# Altium schematic sheet FPGA_Ports.SchDoc
size 558 x 431 mm; SheetNumber: 7; SheetTotal: 13
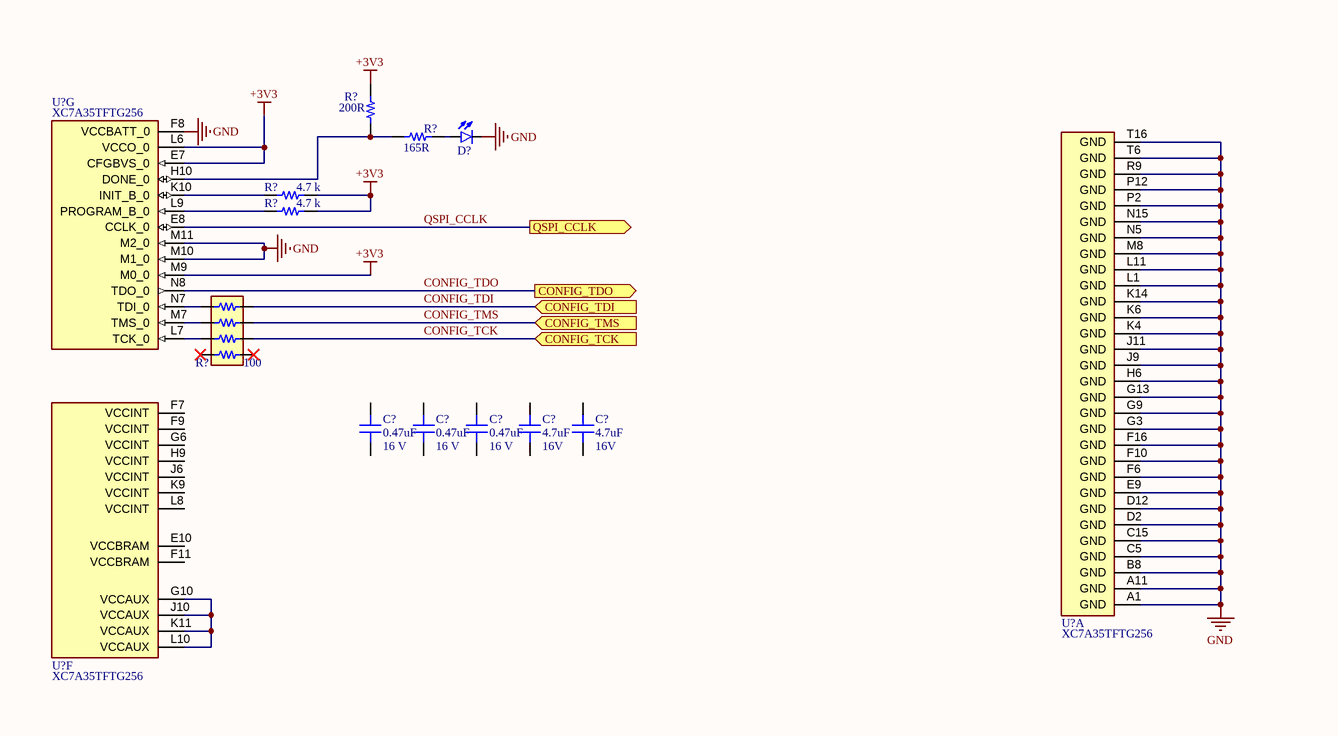
[diagram p0: FPGA_Ports.SchDoc, top right]
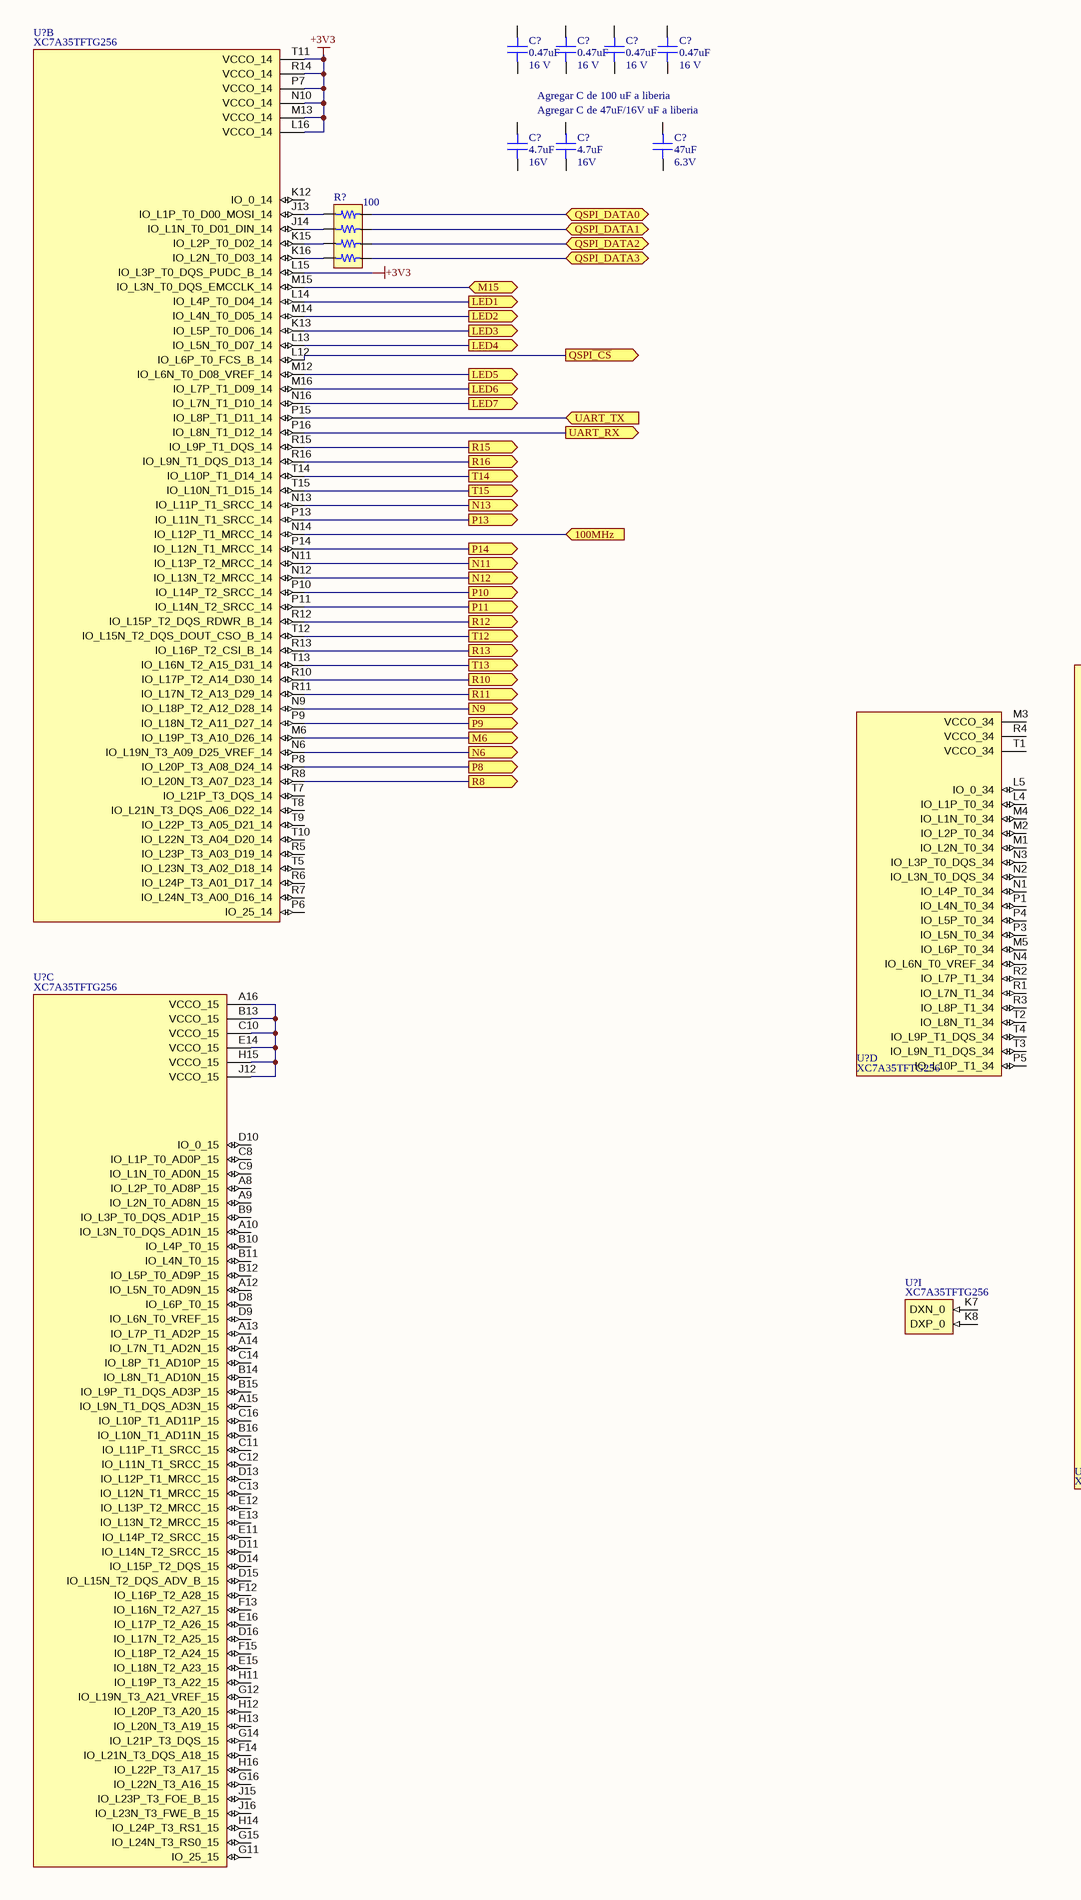
[diagram p1: FPGA_Ports.SchDoc, bottom left]
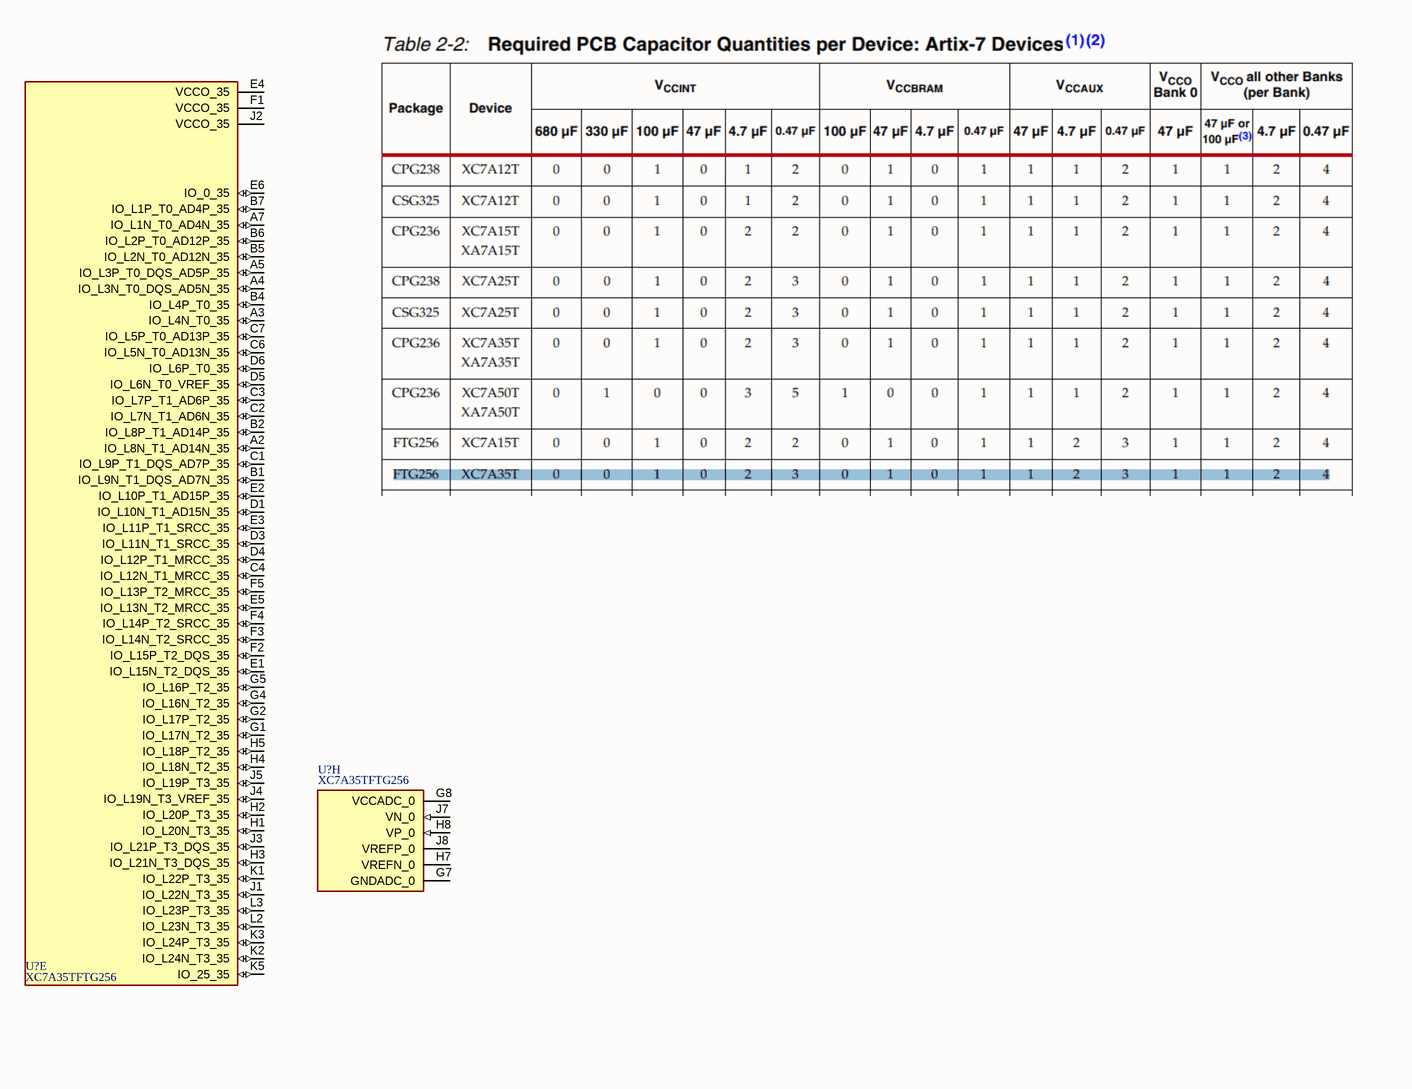
[diagram p2: FPGA_Ports.SchDoc, bottom right]

## Parts
(Parts that share a designator on the sheet are numbered #1, #2 ... from top to bottom, then left to right.)
C?#1  0.47uF  Voltage: 16 V  [CAP0805]
C?#2  0.47uF  Voltage: 16 V  [CAP0805]
C?#3  0.47uF  Voltage: 16 V  [CAP0805]
C?#4  0.47uF  Voltage: 16 V  [CAP0805]
C?#5  4.7uF  Voltage: 16V  [CAP0805]
C?#6  4.7uF  Voltage: 16V  [CAP0805]
C?#7  47uF  Voltage: 6.3V  [CAP0805]
C?#8  0.47uF  Voltage: 16 V  [CAP0805]
C?#9  0.47uF  Voltage: 16 V  [CAP0805]
C?#10  0.47uF  Voltage: 16 V  [CAP0805]
C?#11  4.7uF  Voltage: 16V  [CAP0805]
C?#12  4.7uF  Voltage: 16V  [CAP0805]
D?  597-3305-607F  [0603_LED]  (value not drawn)
R?#1  200R  [RES0603]
R?#2  165R  [RES0603]
R?#3  4.7 k  [RES0603]
R?#4  4.7 k  [RES0603]
R?#5  100  [ArrayResistor-1206]
R?#6  100  [ArrayResistor-1206]
U?#1  XC7A35TFTG256  [BGA-256]  (part G of 9)
U?#2  XC7A35TFTG256  [BGA-256]  (part A of 9)
U?#3  XC7A35TFTG256  [BGA-256]  (part F of 9)
U?#4  XC7A35TFTG256  [BGA-256]  (part B of 9)
U?#5  XC7A35TFTG256  [BGA-256]  (part D of 9)
U?#6  XC7A35TFTG256  [BGA-256]  (part I of 9)
U?#7  XC7A35TFTG256  [BGA-256]  (part H of 9)
U?#8  XC7A35TFTG256  [BGA-256]  (part E of 9)
U?#9  XC7A35TFTG256  [BGA-256]  (part C of 9)

## Ports
100MHz (in), CONFIG_TCK (in), CONFIG_TDI (in), CONFIG_TDO (out), CONFIG_TMS (in), LED1 (out), LED2 (out), LED3 (out), LED4 (out), LED5 (out), LED6 (out), LED7 (out), M6 (out), M15 (bidir), N6 (out), N9 (out), N11 (out), N12 (out), N13 (out), P8 (out), P9 (out), P10 (out), P11 (out), P13 (out), P14 (out), QSPI_CCLK (out), QSPI_DATA0 (bidir), QSPI_DATA1 (bidir), QSPI_DATA2 (bidir), QSPI_DATA3 (bidir), QSPI~{_CS} (out), R8 (out), R10 (out), R11 (out), R12 (out), R13 (out), R15 (out), R16 (out), T12 (out), T13 (out), T14 (out), T15 (out), UART_RX (out), UART_TX (in)

## Nets
+3V3: R?#1.2 R?#3.1 R?#4.1 U?#1.E7(CFGBVS_0) U?#1.L6(VCCO_0) U?#1.M9(M0_0) U?#4.L15(IO_L3P_T0_DQS_PUDC_B_14) U?#4.L16(VCCO_14) U?#4.M13(VCCO_14) U?#4.N10(VCCO_14) U?#4.P7(VCCO_14) U?#4.R14(VCCO_14) U?#4.T11(VCCO_14)
GND: D?.C U?#1.F8(VCCBATT_0) U?#1.M10(M1_0) U?#1.M11(M2_0) U?#2.A1(GND) U?#2.A11(GND) U?#2.B8(GND) U?#2.C5(GND) U?#2.C15(GND) U?#2.D2(GND) U?#2.D12(GND) U?#2.E9(GND) U?#2.F6(GND) U?#2.F10(GND) U?#2.F16(GND) U?#2.G3(GND) U?#2.G9(GND) U?#2.G13(GND) U?#2.H6(GND) U?#2.J9(GND) U?#2.J11(GND) U?#2.K4(GND) U?#2.K6(GND) U?#2.K14(GND) U?#2.L1(GND) U?#2.L11(GND) U?#2.M8(GND) U?#2.N5(GND) U?#2.N15(GND) U?#2.P2(GND) U?#2.P12(GND) U?#2.R9(GND) U?#2.T6(GND) U?#2.T16(GND)
100MHz: U?#4.N14(IO_L12P_T1_MRCC_14) ; port 100MHz
CONFIG_TCK: R?#6.6 ; port CONFIG_TCK
CONFIG_TDI: R?#6.8 ; port CONFIG_TDI
CONFIG_TDO: U?#1.N8(TDO_0) ; port CONFIG_TDO
CONFIG_TMS: R?#6.7 ; port CONFIG_TMS
LED1: U?#4.L14(IO_L4P_T0_D04_14) ; port LED1
LED2: U?#4.M14(IO_L4N_T0_D05_14) ; port LED2
LED3: U?#4.K13(IO_L5P_T0_D06_14) ; port LED3
LED4: U?#4.L13(IO_L5N_T0_D07_14) ; port LED4
LED5: U?#4.M12(IO_L6N_T0_D08_VREF_14) ; port LED5
LED6: U?#4.M16(IO_L7P_T1_D09_14) ; port LED6
LED7: U?#4.N16(IO_L7N_T1_D10_14) ; port LED7
M6: U?#4.M6(IO_L19P_T3_A10_D26_14) ; port M6
M15: U?#4.M15(IO_L3N_T0_DQS_EMCCLK_14) ; port M15
N6: U?#4.N6(IO_L19N_T3_A09_D25_VREF_14) ; port N6
N9: U?#4.N9(IO_L18P_T2_A12_D28_14) ; port N9
N11: U?#4.N11(IO_L13P_T2_MRCC_14) ; port N11
N12: U?#4.N12(IO_L13N_T2_MRCC_14) ; port N12
N13: U?#4.N13(IO_L11P_T1_SRCC_14) ; port N13
P8: U?#4.P8(IO_L20P_T3_A08_D24_14) ; port P8
P9: U?#4.P9(IO_L18N_T2_A11_D27_14) ; port P9
P10: U?#4.P10(IO_L14P_T2_SRCC_14) ; port P10
P11: U?#4.P11(IO_L14N_T2_SRCC_14) ; port P11
P13: U?#4.P13(IO_L11N_T1_SRCC_14) ; port P13
P14: U?#4.P14(IO_L12N_T1_MRCC_14) ; port P14
QSPI~{_CS}: U?#4.L12(IO_L6P_T0_FCS_B_14) ; port QSPI~{_CS}
QSPI_CCLK: U?#1.E8(CCLK_0) ; port QSPI_CCLK
QSPI_DATA0: R?#5.8 ; port QSPI_DATA0
QSPI_DATA1: R?#5.7 ; port QSPI_DATA1
QSPI_DATA2: R?#5.6 ; port QSPI_DATA2
QSPI_DATA3: R?#5.5 ; port QSPI_DATA3
R8: U?#4.R8(IO_L20N_T3_A07_D23_14) ; port R8
R10: U?#4.R10(IO_L17P_T2_A14_D30_14) ; port R10
R11: U?#4.R11(IO_L17N_T2_A13_D29_14) ; port R11
R12: U?#4.R12(IO_L15P_T2_DQS_RDWR_B_14) ; port R12
R13: U?#4.R13(IO_L16P_T2_CSI_B_14) ; port R13
R15: U?#4.R15(IO_L9P_T1_DQS_14) ; port R15
R16: U?#4.R16(IO_L9N_T1_DQS_D13_14) ; port R16
T12: U?#4.T12(IO_L15N_T2_DQS_DOUT_CSO_B_14) ; port T12
T13: U?#4.T13(IO_L16N_T2_A15_D31_14) ; port T13
T14: U?#4.T14(IO_L10P_T1_D14_14) ; port T14
T15: U?#4.T15(IO_L10N_T1_D15_14) ; port T15
UART_RX: U?#4.P16(IO_L8N_T1_D12_14) ; port UART_RX
UART_TX: U?#4.P15(IO_L8P_T1_D11_14) ; port UART_TX
NetD?_A: D?.A R?#2.1
NetR?#1_1: R?#1.1 R?#2.2 U?#1.H10(DONE_0)
NetR?#3_2: R?#3.2 U?#1.K10(INIT_B_0)
NetR?#4_2: R?#4.2 U?#1.L9(PROGRAM_B_0)
NetR?#5_1: R?#5.1 U?#4.J13(IO_L1P_T0_D00_MOSI_14)
NetR?#5_2: R?#5.2 U?#4.J14(IO_L1N_T0_D01_DIN_14)
NetR?#5_3: R?#5.3 U?#4.K15(IO_L2P_T0_D02_14)
NetR?#5_4: R?#5.4 U?#4.K16(IO_L2N_T0_D03_14)
NetR?#6_1: R?#6.1 U?#1.N7(TDI_0)
NetR?#6_2: R?#6.2 U?#1.M7(TMS_0)
NetR?#6_3: R?#6.3 U?#1.L7(TCK_0)
NetU?#3_G10: U?#3.G10(VCCAUX) U?#3.J10(VCCAUX) U?#3.K11(VCCAUX) U?#3.L10(VCCAUX)
NetU?#9_A16: U?#9.A16(VCCO_15) U?#9.B13(VCCO_15) U?#9.C10(VCCO_15) U?#9.E14(VCCO_15) U?#9.H15(VCCO_15) U?#9.J12(VCCO_15)

Not connected (* = marked no-connect by the designer): C?#1 1 2; C?#2 1 2; C?#3 1 2; C?#4 1 2; C?#5 1 2; C?#6 1 2; C?#7 1 2; C?#8 1 2; C?#9 1 2; C?#10 1 2; C?#11 1 2; C?#12 1 2; R?#6 4* 5*; U?#3 E10(VCCBRAM) F7(VCCINT) F9(VCCINT) F11(VCCBRAM) G6(VCCINT) H9(VCCINT) J6(VCCINT) K9(VCCINT) L8(VCCINT); U?#4 K12(IO_0_14) P6(IO_25_14) R5(IO_L23P_T3_A03_D19_14) R6(IO_L24P_T3_A01_D17_14) R7(IO_L24N_T3_A00_D16_14) T5(IO_L23N_T3_A02_D18_14) T7(IO_L21P_T3_DQS_14) T8(IO_L21N_T3_DQS_A06_D22_14) T9(IO_L22P_T3_A05_D21_14) T10(IO_L22N_T3_A04_D20_14); U?#5 L4(IO_L1P_T0_34) L5(IO_0_34) M1(IO_L2N_T0_34) M2(IO_L2P_T0_34) M3(VCCO_34) M4(IO_L1N_T0_34) M5(IO_L6P_T0_34) N1(IO_L4P_T0_34) N2(IO_L3N_T0_DQS_34) N3(IO_L3P_T0_DQS_34) N4(IO_L6N_T0_VREF_34) P1(IO_L4N_T0_34) P3(IO_L5N_T0_34) P4(IO_L5P_T0_34) P5(IO_L10P_T1_34) R1(IO_L7N_T1_34) R2(IO_L7P_T1_34) R3(IO_L8P_T1_34) R4(VCCO_34) T1(VCCO_34) T2(IO_L8N_T1_34) T3(IO_L9N_T1_DQS_34) T4(IO_L9P_T1_DQS_34); U?#6 K7(DXN_0) K8(DXP_0); U?#7 G7(GNDADC_0) G8(VCCADC_0) H7(VREFN_0) H8(VP_0) J7(VN_0) J8(VREFP_0); U?#8 A2(IO_L8N_T1_AD14N_35) A3(IO_L4N_T0_35) A4(IO_L3N_T0_DQS_AD5N_35) A5(IO_L3P_T0_DQS_AD5P_35) A7(IO_L1N_T0_AD4N_35) B1(IO_L9N_T1_DQS_AD7N_35) B2(IO_L8P_T1_AD14P_35) B4(IO_L4P_T0_35) B5(IO_L2N_T0_AD12N_35) B6(IO_L2P_T0_AD12P_35) B7(IO_L1P_T0_AD4P_35) C1(IO_L9P_T1_DQS_AD7P_35) C2(IO_L7N_T1_AD6N_35) C3(IO_L7P_T1_AD6P_35) C4(IO_L12N_T1_MRCC_35) C6(IO_L5N_T0_AD13N_35) C7(IO_L5P_T0_AD13P_35) D1(IO_L10N_T1_AD15N_35) D3(IO_L11N_T1_SRCC_35) D4(IO_L12P_T1_MRCC_35) D5(IO_L6N_T0_VREF_35) D6(IO_L6P_T0_35) E1(IO_L15N_T2_DQS_35) E2(IO_L10P_T1_AD15P_35) E3(IO_L11P_T1_SRCC_35) E4(VCCO_35) E5(IO_L13N_T2_MRCC_35) E6(IO_0_35) F1(VCCO_35) F2(IO_L15P_T2_DQS_35) F3(IO_L14N_T2_SRCC_35) F4(IO_L14P_T2_SRCC_35) F5(IO_L13P_T2_MRCC_35) G1(IO_L17N_T2_35) G2(IO_L17P_T2_35) G4(IO_L16N_T2_35) G5(IO_L16P_T2_35) H1(IO_L20N_T3_35) H2(IO_L20P_T3_35) H3(IO_L21N_T3_DQS_35) H4(IO_L18N_T2_35) H5(IO_L18P_T2_35) J1(IO_L22N_T3_35) J2(VCCO_35) J3(IO_L21P_T3_DQS_35) J4(IO_L19N_T3_VREF_35) J5(IO_L19P_T3_35) K1(IO_L22P_T3_35) K2(IO_L24N_T3_35) K3(IO_L24P_T3_35) K5(IO_25_35) L2(IO_L23N_T3_35) L3(IO_L23P_T3_35); U?#9 A8(IO_L2P_T0_AD8P_15) A9(IO_L2N_T0_AD8N_15) A10(IO_L3N_T0_DQS_AD1N_15) A12(IO_L5N_T0_AD9N_15) A13(IO_L7P_T1_AD2P_15) A14(IO_L7N_T1_AD2N_15) A15(IO_L9N_T1_DQS_AD3N_15) B9(IO_L3P_T0_DQS_AD1P_15) B10(IO_L4P_T0_15) B11(IO_L4N_T0_15) B12(IO_L5P_T0_AD9P_15) B14(IO_L8N_T1_AD10N_15) B15(IO_L9P_T1_DQS_AD3P_15) B16(IO_L10N_T1_AD11N_15) C8(IO_L1P_T0_AD0P_15) C9(IO_L1N_T0_AD0N_15) C11(IO_L11P_T1_SRCC_15) C12(IO_L11N_T1_SRCC_15) C13(IO_L12N_T1_MRCC_15) C14(IO_L8P_T1_AD10P_15) C16(IO_L10P_T1_AD11P_15) D8(IO_L6P_T0_15) D9(IO_L6N_T0_VREF_15) D10(IO_0_15) D11(IO_L14N_T2_SRCC_15) D13(IO_L12P_T1_MRCC_15) D14(IO_L15P_T2_DQS_15) D15(IO_L15N_T2_DQS_ADV_B_15) D16(IO_L17N_T2_A25_15) E11(IO_L14P_T2_SRCC_15) E12(IO_L13P_T2_MRCC_15) E13(IO_L13N_T2_MRCC_15) E15(IO_L18N_T2_A23_15) E16(IO_L17P_T2_A26_15) F12(IO_L16P_T2_A28_15) F13(IO_L16N_T2_A27_15) F14(IO_L21N_T3_DQS_A18_15) F15(IO_L18P_T2_A24_15) G11(IO_25_15) G12(IO_L19N_T3_A21_VREF_15) G14(IO_L21P_T3_DQS_15) G15(IO_L24N_T3_RS0_15) G16(IO_L22N_T3_A16_15) H11(IO_L19P_T3_A22_15) H12(IO_L20P_T3_A20_15) H13(IO_L20N_T3_A19_15) H14(IO_L24P_T3_RS1_15) H16(IO_L22P_T3_A17_15) J15(IO_L23P_T3_FOE_B_15) J16(IO_L23N_T3_FWE_B_15)

## Notes on the sheet
- (near C?#2) Agregar C de 100 uF a liberia
- (near C?#6) Agregar C de 47uF/16V uF a liberia
- DWG. NO.
- REV.
- SHT.
- REVISION
- DESCRIPTION
- DATE
- APPROVED
- THIS DOCUMENT AND THE DATA DISCLOSED HEREIN OR HEREWITH IS THE PROPERTY OF ALTIUM LIMITED AND MAY BE FREELY DISTRIBUTED IN WHOLE. NO RIGHTS ARE RESERVED OR EXPRESS OR IMPLIED WARANTEE GIVEN.
- ENG:
- DSN:
- APPROVALS
- PROJECT
- DOCUMENT REVISION:
- DESIGN ITEM:
- CHK:
- BOM:
- REFERENCE DOCUMENTS
- PROJECT REVISION:
- TITLE
- FAB DWG:
- PCB DWG:
- ASSY DWG:
- SCALE:
- SIZE
- C
- CAGE CODE
- FILE NAME
- DWG NO.
- SHEET
- OF
- REV

## Library data of the parts
C?#1-C?#4 C?#8-C?#10 = C0805C474K4RACTU: SMD Comm X7R, Ceramic, 0.47 uF, 10%, 16 VDC, X7R, SMD, MLCC, Temperature Stable, Class II, 0805; ComponentLink1Description: DataSheet; ComponentLink1URL: https://content.kemet.com/datasheets/KEM_C1002_X7R_SMD.pdf; Size: 0805; ComponentLink2Description: DigiKey; ComponentLink2URL: https://www.digikey.com/es/products/detail/kemet/C0805C474K4RAC7800/2212885?s=N4IgTCBcDaIMIAYAcCCscAsB2DBpDASgIJwAqAqiALoC%2BQA; ComponentLink3Description: ProductPage; ComponentLink3URL: https://www.kemet.com/en/us/product/C0805C474K4RACTU.html; PartNumber: C0805C474K4RACTU
C?#5 C?#6 C?#11 C?#12 = C0805C475K4RACTU: SMD Comm X7R, Ceramic, 4.7 uF, 10%, 16 VDC, X7R, SMD, MLCC, Temperature Stable, Class II, 0805; Variation: +/- 10%; ComponentLink1Description: DataSheet; ComponentLink1URL: https://content.kemet.com/datasheets/KEM_C1002_X7R_SMD.pdf; Size: 0805; ComponentLink2Description: DigiKey; ComponentLink2URL: https://www.digikey.com/es/products/detail/kemet/C0805C475K4RAC7800/3317621?s=N4IgTCBcDaIMIAYAcCCscAsB2VBpDASgIJwAqAqiALoC%2BQA; PartNumber: C0805C475K4RACTU; ComponentLink3Description: ProdructPage; ComponentLink3URL: https://www.kemet.com/en/us/product/C0805C475K4RACTU.html; Capacitance: 4.7 uF
C?#7 = CL21A476MQYNNNE: CAP CER 47UF 6.3V X5R 0805; ComponentLink1Description: DataSheet; ComponentLink1URL: https://content.kemet.com/datasheets/KEM_C1002_X7R_SMD.pdf; Size: 0805; ComponentLink2Description: DigiKey; ComponentLink2URL: https://www.digikey.com/en/products/detail/samsung-electro-mechanics/CL21A476MQYNNNE/3887510
D? = LED_BLUE_0603: LED blue diffused 0603 SMD; ComponentLink1Description: DataSheet; ComponentLink1URL: https://www.we-online.com/components/products/datasheet/150060BS55040.pdf; ComponentLink2Description: DigiKey; ComponentLink2URL: https://www.digikey.com/es/products/detail/w%C3%BCrth-elektronik/150060BS55040/8557178?s=N4IgTCBcDaIDoBcCMBWADGgbGgQgZRXQBY0QBdAXyA; Colour: Blue; Size: 0603
R?#1 = CRCW0603200RFKEA: RES SMD 200 OHM 1% 1/10W 0603; Manufacturer: Vishay; Value: 200; Power: 0.1 W; ComponentLink1Description: DataSheet; ComponentLink1URL: https://www.vishay.com/docs/20035/dcrcwe3.pdf; Size: 0603; ComponentLink2Description: DigiKey; ComponentLink2URL: https://www.digikey.com/es/products/detail/vishay-dale/CRCW0603200RFKEA/1174586?s=N4IgTCBcDaIMICU4HUAMA2VBmMrUIDEBpAUQEEQBdAXyA
R?#2 = CRCW0603165RFKEA: RES SMD 165 OHM 1% 1/10W 0603; Manufacturer: Vishay; Value: 165; Power: 0.1 W; ComponentLink1Description: DataSheet; ComponentLink1URL: https://www.vishay.com/docs/20035/dcrcwe3.pdf; Size: 0603; ComponentLink2Description: DigiKey; ComponentLink2URL: https://www.digikey.com/es/products/detail/vishay-dale/CRCW0603165RFKEA/1174577?s=N4IgTCBcDaIMICU4HUAMA2VBmAjOgrAgGIDSAogIIgC6AvkA
R?#3 R?#4 = CRCW06034K70FKEA: RES SMD 4.7K OHM 1% 1/10W 0603; Manufacturer: Vishay; ComponentLink1Description: DataSheet; ComponentLink1URL: https://www.vishay.com/docs/20035/dcrcwe3.pdf; Size: 0603; ComponentLink2Description: DigiKey; ComponentLink2URL: https://www.digikey.com/en/products/detail/vishay-dale/CRCW06034K70FKEA/1174744; Power: 1/10 W
R?#5 R?#6 = EXB-38V101JV: RES ARRAY 4 RES 100 OHM 1206; Elements: 4; Value: 100 Ohms; ComponentLink1Description: DigiKey; ComponentLink1URL: https://www.digikey.com/en/products/detail/panasonic-electronic-components/EXB-38V101JV/256519?s=N4IgTCBcDaIKIA0BCBaAzADgGoEYAMOAUliALoC%2BQA; ComponentLink2Description: DataSheet; ComponentLink2URL: https://industrial.panasonic.com/cdbs/www-data/pdf/AOC0000/AOC0000C14.pdf; Size: 1206
U?#1-U?#9 = XC7A35TFTG256: FPGA